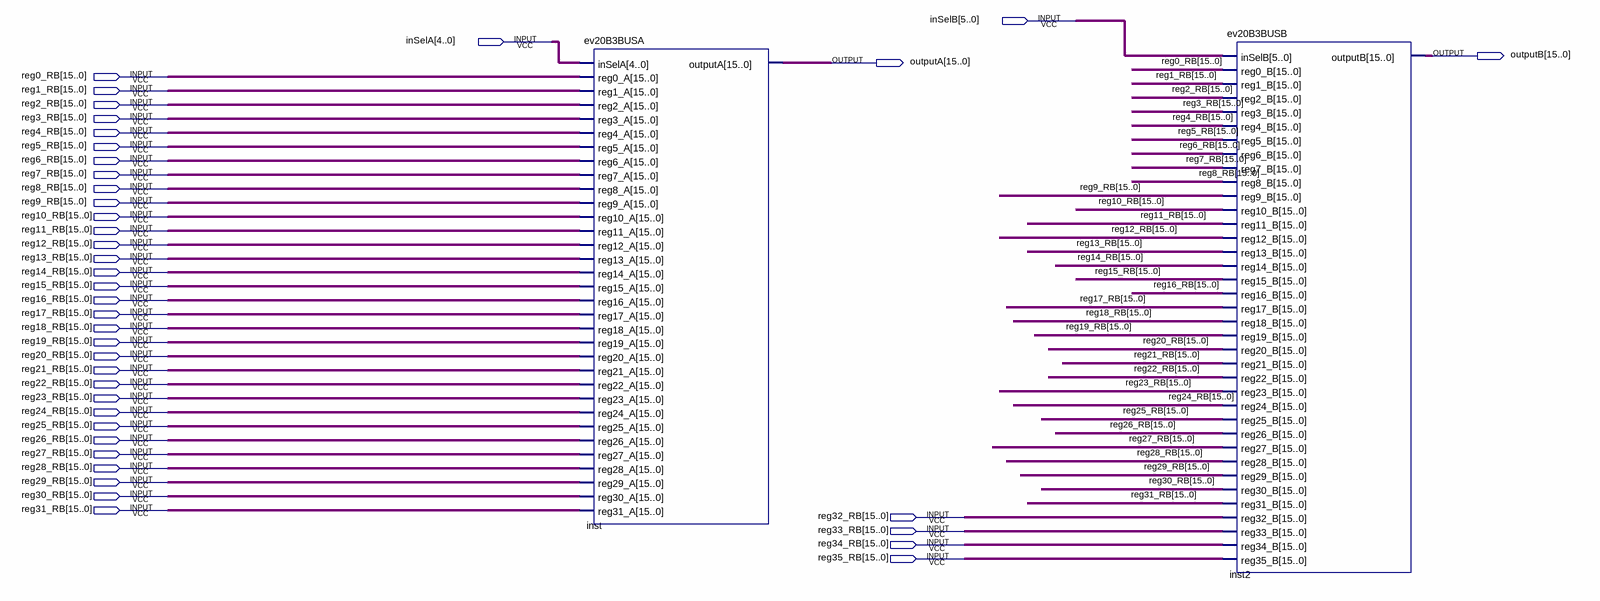
[diagram p0: schematic sheet]
// Quartus schematic ev20BLOQUE3.bdf as structural Verilog: 2 symbols, 40 pins
module ev20BLOQUE3 (
  input  [5:0] inSelB,
  input  [4:0] inSelA,
  input  [15:0] reg0_RB,
  input  [15:0] reg1_RB,
  input  [15:0] reg2_RB,
  input  [15:0] reg3_RB,
  input  [15:0] reg4_RB,
  input  [15:0] reg5_RB,
  input  [15:0] reg6_RB,
  input  [15:0] reg7_RB,
  input  [15:0] reg8_RB,
  input  [15:0] reg9_RB,
  input  [15:0] reg10_RB,
  input  [15:0] reg11_RB,
  input  [15:0] reg12_RB,
  input  [15:0] reg13_RB,
  input  [15:0] reg14_RB,
  input  [15:0] reg15_RB,
  input  [15:0] reg16_RB,
  input  [15:0] reg17_RB,
  input  [15:0] reg18_RB,
  input  [15:0] reg19_RB,
  input  [15:0] reg20_RB,
  input  [15:0] reg21_RB,
  input  [15:0] reg22_RB,
  input  [15:0] reg23_RB,
  input  [15:0] reg24_RB,
  input  [15:0] reg25_RB,
  input  [15:0] reg26_RB,
  input  [15:0] reg27_RB,
  input  [15:0] reg28_RB,
  input  [15:0] reg29_RB,
  input  [15:0] reg30_RB,
  input  [15:0] reg31_RB,
  input  [15:0] reg32_RB,
  input  [15:0] reg33_RB,
  input  [15:0] reg34_RB,
  input  [15:0] reg35_RB,
  output [15:0] outputB,
  output [15:0] outputA
);

  ev20B3BUSA inst (
    .inSelA(inSelA), .reg0_A(reg0_RB), .reg1_A(reg1_RB), .reg2_A(reg2_RB), .reg3_A(reg3_RB),
    .reg4_A(reg4_RB), .reg5_A(reg5_RB), .reg6_A(reg6_RB), .reg7_A(reg7_RB), .reg8_A(reg8_RB),
    .reg9_A(reg9_RB), .reg10_A(reg10_RB), .reg11_A(reg11_RB), .reg12_A(reg12_RB), .reg13_A(reg13_RB),
    .reg14_A(reg14_RB), .reg15_A(reg15_RB), .reg16_A(reg16_RB), .reg17_A(reg17_RB), .reg18_A(reg18_RB),
    .reg19_A(reg19_RB), .reg20_A(reg20_RB), .reg21_A(reg21_RB), .reg22_A(reg22_RB), .reg23_A(reg23_RB),
    .reg24_A(reg24_RB), .reg25_A(reg25_RB), .reg26_A(reg26_RB), .reg27_A(reg27_RB), .reg28_A(reg28_RB),
    .reg29_A(reg29_RB), .reg30_A(reg30_RB), .reg31_A(reg31_RB), .outputA(outputA));
  ev20B3BUSB inst2 (
    .inSelB(inSelB), .reg0_B(reg0_RB), .reg1_B(reg1_RB), .reg2_B(reg2_RB), .reg3_B(reg3_RB),
    .reg4_B(reg4_RB), .reg5_B(reg5_RB), .reg6_B(reg6_RB), .reg7_B(reg7_RB), .reg8_B(reg8_RB),
    .reg9_B(reg9_RB), .reg10_B(reg10_RB), .reg11_B(reg11_RB), .reg12_B(reg12_RB), .reg13_B(reg13_RB),
    .reg14_B(reg14_RB), .reg15_B(reg15_RB), .reg16_B(reg16_RB), .reg17_B(reg17_RB), .reg18_B(reg18_RB),
    .reg19_B(reg19_RB), .reg20_B(reg20_RB), .reg21_B(reg21_RB), .reg22_B(reg22_RB), .reg23_B(reg23_RB),
    .reg24_B(reg24_RB), .reg25_B(reg25_RB), .reg26_B(reg26_RB), .reg27_B(reg27_RB), .reg28_B(reg28_RB),
    .reg29_B(reg29_RB), .reg30_B(reg30_RB), .reg31_B(reg31_RB), .reg32_B(reg32_RB), .reg33_B(reg33_RB),
    .reg34_B(reg34_RB), .reg35_B(reg35_RB), .outputB(outputB));
endmodule
